# Altium schematic sheet matrixkeypad.SchDoc
size A4
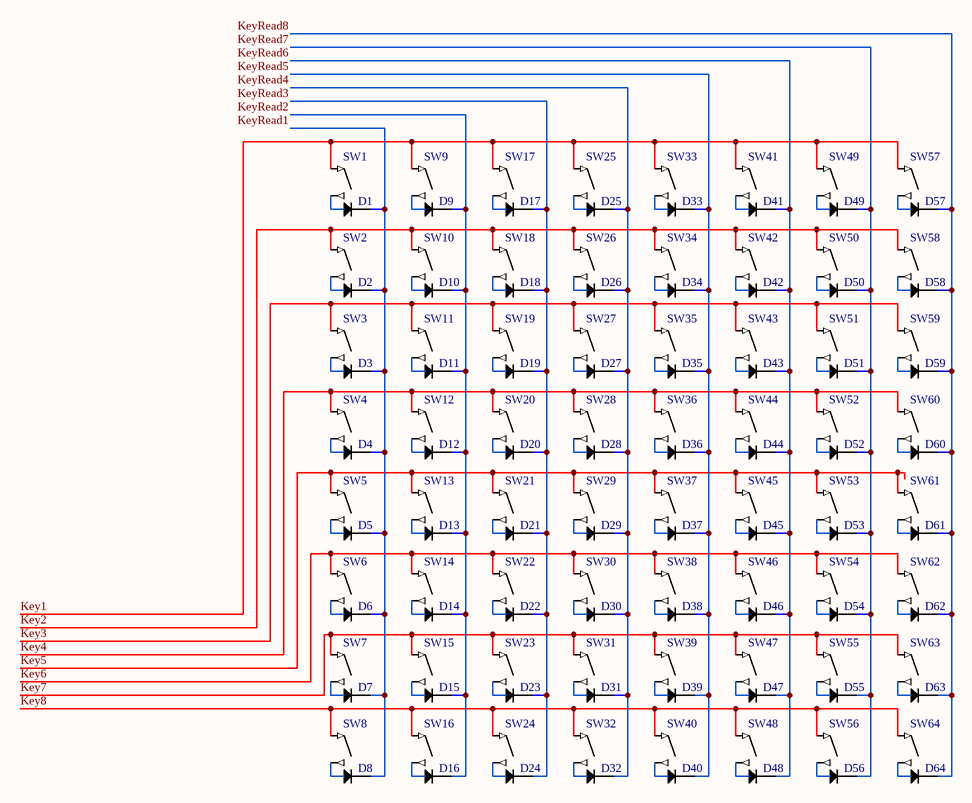
[diagram p0: matrixkeypad.SchDoc]

## Parts
D1  1N4148  [SOD123]  (value not drawn)
D2  1N4148  [SOD123]  (value not drawn)
D3  1N4148  [SOD123]  (value not drawn)
D4  1N4148  [SOD123]  (value not drawn)
D5  1N4148  [SOD123]  (value not drawn)
D6  1N4148  [SOD123]  (value not drawn)
D7  1N4148  [SOD123]  (value not drawn)
D8  1N4148  [SOD123]  (value not drawn)
D9  1N4148  [SOD123]  (value not drawn)
D10  1N4148  [SOD123]  (value not drawn)
D11  1N4148  [SOD123]  (value not drawn)
D12  1N4148  [SOD123]  (value not drawn)
D13  1N4148  [SOD123]  (value not drawn)
D14  1N4148  [SOD123]  (value not drawn)
D15  1N4148  [SOD123]  (value not drawn)
D16  1N4148  [SOD123]  (value not drawn)
D17  1N4148  [SOD123]  (value not drawn)
D18  1N4148  [SOD123]  (value not drawn)
D19  1N4148  [SOD123]  (value not drawn)
D20  1N4148  [SOD123]  (value not drawn)
D21  1N4148  [SOD123]  (value not drawn)
D22  1N4148  [SOD123]  (value not drawn)
D23  1N4148  [SOD123]  (value not drawn)
D24  1N4148  [SOD123]  (value not drawn)
D25  1N4148  [SOD123]  (value not drawn)
D26  1N4148  [SOD123]  (value not drawn)
D27  1N4148  [SOD123]  (value not drawn)
D28  1N4148  [SOD123]  (value not drawn)
D29  1N4148  [SOD123]  (value not drawn)
D30  1N4148  [SOD123]  (value not drawn)
D31  1N4148  [SOD123]  (value not drawn)
D32  1N4148  [SOD123]  (value not drawn)
D33  1N4148  [SOD123]  (value not drawn)
D34  1N4148  [SOD123]  (value not drawn)
D35  1N4148  [SOD123]  (value not drawn)
D36  1N4148  [SOD123]  (value not drawn)
D37  1N4148  [SOD123]  (value not drawn)
D38  1N4148  [SOD123]  (value not drawn)
D39  1N4148  [SOD123]  (value not drawn)
D40  1N4148  [SOD123]  (value not drawn)
D41  1N4148  [SOD123]  (value not drawn)
D42  1N4148  [SOD123]  (value not drawn)
D43  1N4148  [SOD123]  (value not drawn)
D44  1N4148  [SOD123]  (value not drawn)
D45  1N4148  [SOD123]  (value not drawn)
D46  1N4148  [SOD123]  (value not drawn)
D47  1N4148  [SOD123]  (value not drawn)
D48  1N4148  [SOD123]  (value not drawn)
D49  1N4148  [SOD123]  (value not drawn)
D50  1N4148  [SOD123]  (value not drawn)
D51  1N4148  [SOD123]  (value not drawn)
D52  1N4148  [SOD123]  (value not drawn)
D53  1N4148  [SOD123]  (value not drawn)
D54  1N4148  [SOD123]  (value not drawn)
D55  1N4148  [SOD123]  (value not drawn)
D56  1N4148  [SOD123]  (value not drawn)
D57  1N4148  [SOD123]  (value not drawn)
D58  1N4148  [SOD123]  (value not drawn)
D59  1N4148  [SOD123]  (value not drawn)
D60  1N4148  [SOD123]  (value not drawn)
D61  1N4148  [SOD123]  (value not drawn)
D62  1N4148  [SOD123]  (value not drawn)
D63  1N4148  [SOD123]  (value not drawn)
D64  1N4148  [SOD123]  (value not drawn)
SW1  (no value)  [PAD]
SW2  (no value)  [PAD]
SW3  (no value)  [PAD]
SW4  (no value)  [PAD]
SW5  (no value)  [PAD]
SW6  (no value)  [PAD]
SW7  (no value)  [PAD]
SW8  (no value)  [PAD]
SW9  (no value)  [PAD]
SW10  (no value)  [PAD]
SW11  (no value)  [PAD]
SW12  (no value)  [PAD]
SW13  (no value)  [PAD]
SW14  (no value)  [PAD]
SW15  (no value)  [PAD]
SW16  (no value)  [PAD]
SW17  (no value)  [PAD]
SW18  (no value)  [PAD]
SW19  (no value)  [PAD]
SW20  (no value)  [PAD]
SW21  (no value)  [PAD]
SW22  (no value)  [PAD]
SW23  (no value)  [PAD]
SW24  (no value)  [PAD]
SW25  (no value)  [PAD]
SW26  (no value)  [PAD]
SW27  (no value)  [PAD]
SW28  (no value)  [PAD]
SW29  (no value)  [PAD]
SW30  (no value)  [PAD]
SW31  (no value)  [PAD]
SW32  (no value)  [PAD]
SW33  (no value)  [PAD]
SW34  (no value)  [PAD]
SW35  (no value)  [PAD]
SW36  (no value)  [PAD]
SW37  (no value)  [PAD]
SW38  (no value)  [PAD]
SW39  (no value)  [PAD]
SW40  (no value)  [PAD]
SW41  (no value)  [PAD]
SW42  (no value)  [PAD]
SW43  (no value)  [PAD]
SW44  (no value)  [PAD]
SW45  (no value)  [PAD]
SW46  (no value)  [PAD]
SW47  (no value)  [PAD]
SW48  (no value)  [PAD]
SW49  (no value)  [PAD]
SW50  (no value)  [PAD]
SW51  (no value)  [PAD]
SW52  (no value)  [PAD]
SW53  (no value)  [PAD]
SW54  (no value)  [PAD]
SW55  (no value)  [PAD]
SW56  (no value)  [PAD]
SW57  (no value)  [PAD]
SW58  (no value)  [PAD]
SW59  (no value)  [PAD]
SW60  (no value)  [PAD]
SW61  (no value)  [PAD]
SW62  (no value)  [PAD]
SW63  (no value)  [PAD]
SW64  (no value)  [PAD]

## Nets
Key1: SW1.1 SW9.1 SW17.1 SW25.1 SW33.1 SW41.1 SW49.1 SW57.1
Key2: SW2.1 SW10.1 SW18.1 SW26.1 SW34.1 SW42.1 SW50.1 SW58.1
Key3: SW3.1 SW11.1 SW19.1 SW27.1 SW35.1 SW43.1 SW51.1 SW59.1
Key4: SW4.1 SW12.1 SW20.1 SW28.1 SW36.1 SW44.1 SW52.1 SW60.1
Key5: SW5.1 SW13.1 SW21.1 SW29.1 SW37.1 SW45.1 SW53.1 SW61.1
Key6: SW6.1 SW14.1 SW22.1 SW30.1 SW38.1 SW46.1 SW54.1 SW62.1
Key7: SW7.1 SW15.1 SW23.1 SW31.1 SW39.1 SW47.1 SW55.1 SW63.1
Key8: SW8.1 SW16.1 SW24.1 SW32.1 SW40.1 SW48.1 SW56.1 SW64.1
KeyRead1: D1.2 D2.2 D3.2 D4.2 D5.2 D6.2 D7.2 D8.2
KeyRead2: D9.2 D10.2 D11.2 D12.2 D13.2 D14.2 D15.2 D16.2
KeyRead3: D17.2 D18.2 D19.2 D20.2 D21.2 D22.2 D23.2 D24.2
KeyRead4: D25.2 D26.2 D27.2 D28.2 D29.2 D30.2 D31.2 D32.2
KeyRead5: D33.2 D34.2 D35.2 D36.2 D37.2 D38.2 D39.2 D40.2
KeyRead6: D41.2 D42.2 D43.2 D44.2 D45.2 D46.2 D47.2 D48.2
KeyRead7: D49.2 D50.2 D51.2 D52.2 D53.2 D54.2 D55.2 D56.2
KeyRead8: D57.2 D58.2 D59.2 D60.2 D61.2 D62.2 D63.2 D64.2
NetD1_1: D1.1 SW1.2(Out)
NetD2_1: D2.1 SW2.2(Out)
NetD3_1: D3.1 SW3.2(Out)
NetD4_1: D4.1 SW4.2(Out)
NetD5_1: D5.1 SW5.2(Out)
NetD6_1: D6.1 SW6.2(Out)
NetD7_1: D7.1 SW7.2(Out)
NetD8_1: D8.1 SW8.2(Out)
NetD9_1: D9.1 SW9.2(Out)
NetD10_1: D10.1 SW10.2(Out)
NetD11_1: D11.1 SW11.2(Out)
NetD12_1: D12.1 SW12.2(Out)
NetD13_1: D13.1 SW13.2(Out)
NetD14_1: D14.1 SW14.2(Out)
NetD15_1: D15.1 SW15.2(Out)
NetD16_1: D16.1 SW16.2(Out)
NetD17_1: D17.1 SW17.2(Out)
NetD18_1: D18.1 SW18.2(Out)
NetD19_1: D19.1 SW19.2(Out)
NetD20_1: D20.1 SW20.2(Out)
NetD21_1: D21.1 SW21.2(Out)
NetD22_1: D22.1 SW22.2(Out)
NetD23_1: D23.1 SW23.2(Out)
NetD24_1: D24.1 SW24.2(Out)
NetD25_1: D25.1 SW25.2(Out)
NetD26_1: D26.1 SW26.2(Out)
NetD27_1: D27.1 SW27.2(Out)
NetD28_1: D28.1 SW28.2(Out)
NetD29_1: D29.1 SW29.2(Out)
NetD30_1: D30.1 SW30.2(Out)
NetD31_1: D31.1 SW31.2(Out)
NetD32_1: D32.1 SW32.2(Out)
NetD33_1: D33.1 SW33.2(Out)
NetD34_1: D34.1 SW34.2(Out)
NetD35_1: D35.1 SW35.2(Out)
NetD36_1: D36.1 SW36.2(Out)
NetD37_1: D37.1 SW37.2(Out)
NetD38_1: D38.1 SW38.2(Out)
NetD39_1: D39.1 SW39.2(Out)
NetD40_1: D40.1 SW40.2(Out)
NetD41_1: D41.1 SW41.2(Out)
NetD42_1: D42.1 SW42.2(Out)
NetD43_1: D43.1 SW43.2(Out)
NetD44_1: D44.1 SW44.2(Out)
NetD45_1: D45.1 SW45.2(Out)
NetD46_1: D46.1 SW46.2(Out)
NetD47_1: D47.1 SW47.2(Out)
NetD48_1: D48.1 SW48.2(Out)
NetD49_1: D49.1 SW49.2(Out)
NetD50_1: D50.1 SW50.2(Out)
NetD51_1: D51.1 SW51.2(Out)
NetD52_1: D52.1 SW52.2(Out)
NetD53_1: D53.1 SW53.2(Out)
NetD54_1: D54.1 SW54.2(Out)
NetD55_1: D55.1 SW55.2(Out)
NetD56_1: D56.1 SW56.2(Out)
NetD57_1: D57.1 SW57.2(Out)
NetD58_1: D58.1 SW58.2(Out)
NetD59_1: D59.1 SW59.2(Out)
NetD60_1: D60.1 SW60.2(Out)
NetD61_1: D61.1 SW61.2(Out)
NetD62_1: D62.1 SW62.2(Out)
NetD63_1: D63.1 SW63.2(Out)
NetD64_1: D64.1 SW64.2(Out)

## Library data of the parts
SW1-SW64 = SW